# EAGLE design NQSMHS-V2.4B (EAGLE 5.11)

## Sheet 1 of 4
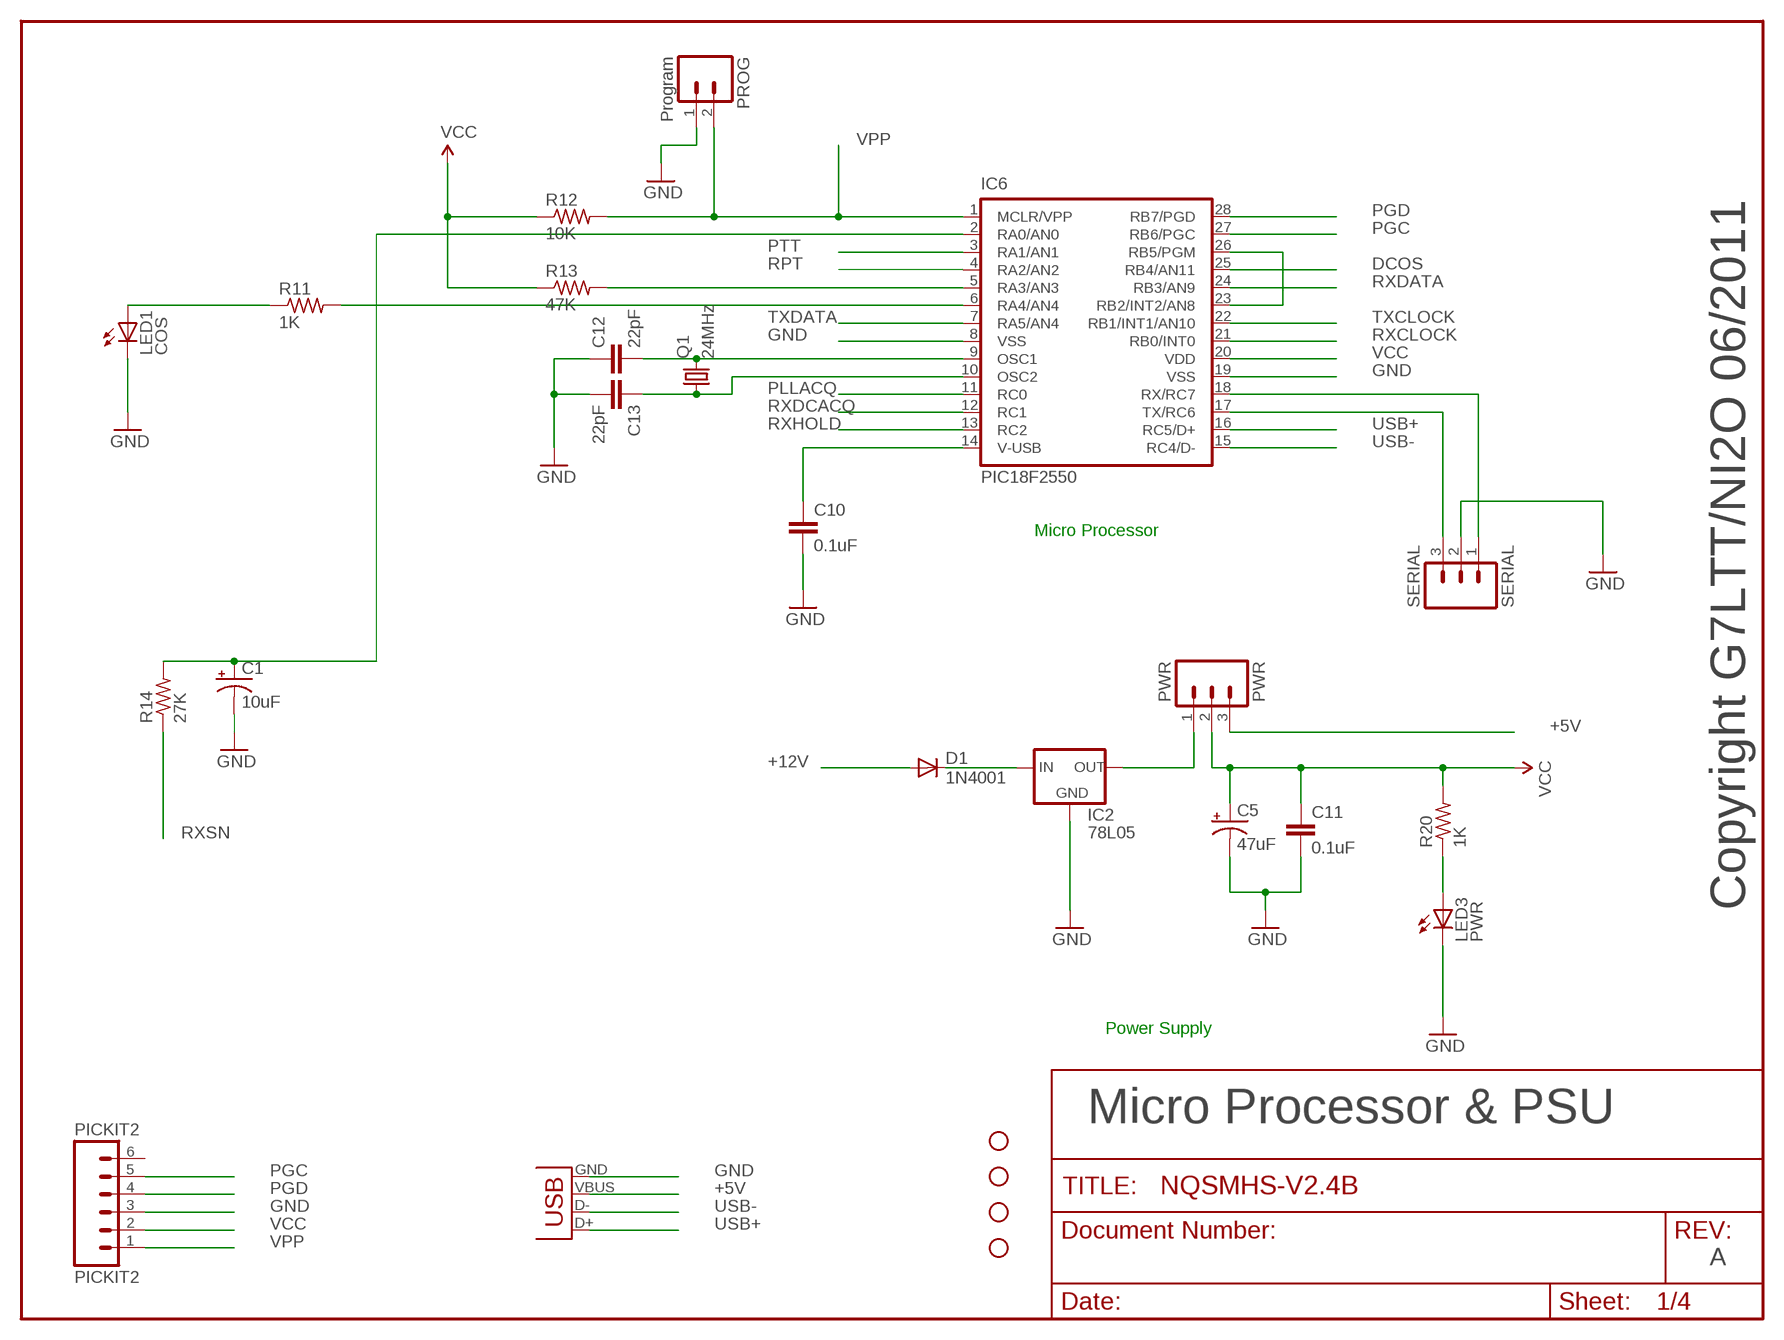
[diagram p0: schematic, sheet 1]

### Parts
C1  10uF  CAP_POLPTH2  [CPOL-RADIAL-10UF-25V]
C5  47uF  CAP_POLPTH2  [CPOL-RADIAL-10UF-25V]
C10  0.1uF  C2.5/2  [C2.5-2]
C11  0.1uF  C2.5/2  [C2.5-2]
C12  22pF  C2.5/2  [C2.5-2]
C13  22pF  C2.5/2  [C2.5-2]
D1  1N4001  DIODEPTH  [DIODE-1N4001]
IC2  78L05  78LXX  [78LXX]
IC6  PIC18F2550  [DIL28-3]
J1  USBPTH  [USB-B-PTH]
JP7  STAND-OFF  [STAND-OFF]
JP8  STAND-OFF  [STAND-OFF]
JP9  STAND-OFF  [STAND-OFF]
JP10  STAND-OFF  [STAND-OFF]
LED1  COS  LED3MM  [LED3MM]
LED3  PWR  LED3MM  [LED3MM]
PICKIT2  PICKIT2  M06SIP  [1X06]
PROG  Program  M02PTH  [1X02]
PWR  PWR  M03PTH  [1X03]
Q1  24MHz  CRYSTALHC49US  [HC49US]
R11  1K  R-US_0207/2V  [0207/2V]
R12  10K  R-US_0207/2V  [0207/2V]
R13  47K  R-US_0207/2V  [0207/2V]
R14  27K  R-US_0207/2V  [0207/2V]
R20  1K  R-US_0207/2V  [0207/2V]
SERIAL  SERIAL  M03PTH  [1X03]

### Nets
+5V: J1.VBUS PWR.3
+12V: D1.A ; also sheet 2
DCOS: IC6.25(RB4/AN11) ; also sheet 3
GND: C1.2(-) C5.2(-) C10.2 C11.2 C12.1 C13.2 IC2.GND IC6.8(VSS) IC6.19(VSS) J1.GND LED1.K(C) LED3.K(C) PICKIT2.3 PROG.1 SERIAL.2 ; also sheet 2,3,4
N$2: D1.C IC2.IN
N$3: IC6.23(RB2/INT2/AN8) IC6.26(RB5/PGM)
N$4: IC6.5(RA3/AN3) R13.2
N$5: IC6.6(RA4/AN4) R11.2
N$6: LED1.A R11.1
N$9: C12.2 IC6.9(OSC1) Q1.2
N$10: C13.1 IC6.10(OSC2) Q1.1
N$11: C10.1 IC6.14(V-USB)
N$12: IC2.OUT PWR.1
N$13: LED3.A R20.1
PGC: IC6.27(RB6/PGC) PICKIT2.5
PGD: IC6.28(RB7/PGD) PICKIT2.4
PLLACQ: IC6.11(RC0) ; also sheet 4
PTT: IC6.3(RA1/AN1) ; also sheet 2
RPT: IC6.4(RA2/AN2)
RX-232: IC6.18(RX/RC7) SERIAL.1
RXCLOCK: IC6.21(RB0/INT0) ; also sheet 4
RXDATA: IC6.24(RB3/AN9) ; also sheet 4
RXDCACQ: IC6.12(RC1) ; also sheet 4
RXHOLD: IC6.13(RC2) ; also sheet 4
RXSN: R14.1 ; also sheet 3,4
TX-232: IC6.17(TX/RC6) SERIAL.3
TX/SN: C1.1(+) IC6.2(RA0/AN0) R14.2
TXCLOCK: IC6.22(RB1/INT1/AN10) ; also sheet 4
TXDATA: IC6.7(RA5/AN4) ; also sheet 4
USB+: IC6.16(RC5/D+) J1.D+
USB-: IC6.15(RC4/D-) J1.D-
VCC: C5.1(+) C11.1 IC6.20(VDD) PICKIT2.2 PWR.2 R12.1 R13.1 R20.2 ; also sheet 2,3,4
VPP: IC6.1(MCLR/VPP) PICKIT2.1 PROG.2 R12.2
Unconnected: PICKIT2.6

### Notes on the sheet
- Micro Processor
- Copyright G7LTT/NI2O 06/2011
- Power Supply
- Micro Processor & PSU
- A

## Sheet 2 of 4
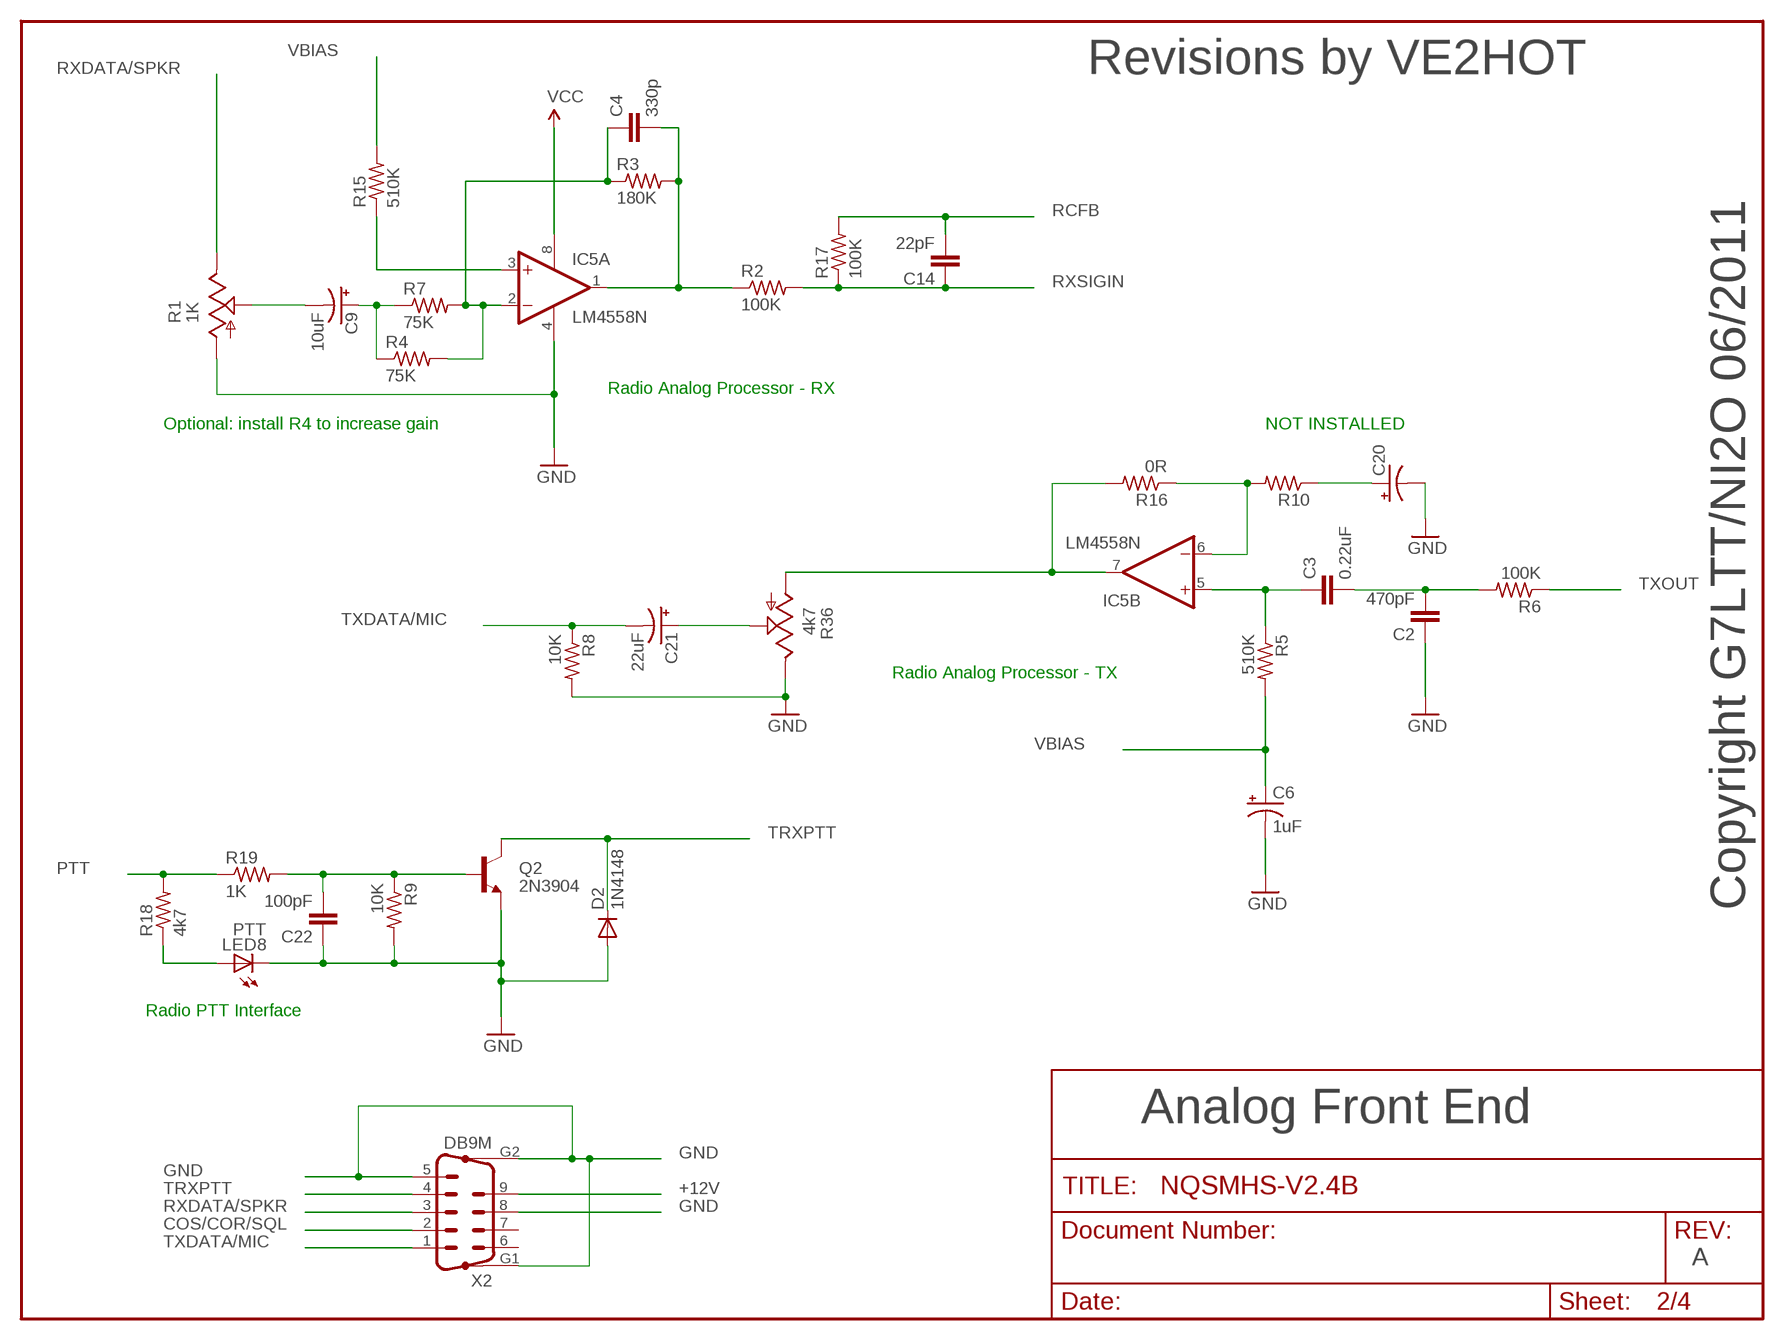
[diagram p1: schematic, sheet 2]

### Parts
C2  470pF  C2.5/2  [C2.5-2]
C3  0.22uF  C2.5/2  [C2.5-2]
C4  330p  C2.5/2  [C2.5-2]
C6  1uF  CAP_POLPTH2  [CPOL-RADIAL-10UF-25V]
C9  10uF  CAP_POLPTH2  [CPOL-RADIAL-10UF-25V]
C14  22pF  C2.5/2  [C2.5-2]
C20  CAP_POLPTH2  [CPOL-RADIAL-10UF-25V]
C21  22uF  CAP_POLPTH2  [CPOL-RADIAL-10UF-25V]
C22  100pF  C2.5/2  [C2.5-2]
D2  1N4148  [DO35-10]
IC5  LM4558N  [DIL08]
LED8  PTT  LED3MM  [LED3MM]
Q2  2N3904  TRANSISTOR_NPNTO92  [TO-92]
R1  1K  TRIM_US-CA6V  [CA6V]
R2  100K  R-US_0207/2V  [0207/2V]
R3  180K  R-US_0207/2V  [0207/2V]
R4  75K  R-US_0207/2V  [0207/2V]
R5  510K  R-US_0207/2V  [0207/2V]
R6  100K  R-US_0207/2V  [0207/2V]
R7  75K  R-US_0207/2V  [0207/2V]
R8  10K  R-US_0207/2V  [0207/2V]
R9  10K  R-US_0207/2V  [0207/2V]
R10  R-US_0207/2V  [0207/2V]
R15  510K  R-US_0207/2V  [0207/2V]
R16  0R  R-US_0207/2V  [0207/2V]
R17  100K  R-US_0207/2V  [0207/2V]
R18  4k7  R-US_0207/2V  [0207/2V]
R19  1K  R-US_0207/2V  [0207/2V]
R36  4k7  TRIM_US-CA6V  [CA6V]
X2  DB9M  M09HP  [M09HP]

### Nets
+12V: X2.9 ; also sheet 1
COS/COR/SQL: X2.2
GND: C2.1 C6.2(-) C20.2(-) C22.1 D2.A IC5.4(P:V-) LED8.K(C) Q2.1(E) R1.A R8.2 R9.2 R36.E X2.5 X2.8 X2.G1 X2.G2 ; also sheet 1,3,4
N$8: C2.2 C3.2 R6.2
N$15: C22.2 Q2.2(B) R9.1 R19.2
N$17: LED8.A R18.1
N$18: C9.2(-) R1.S
N$19: IC5.7(B:OUT) R16.2 R36.A
N$20: C9.1(+) R4.1 R7.1
N$23: C4.2 IC5.1(A:OUT) R2.1 R3.2
N$25: C3.1 IC5.5(B:+IN) R5.1
N$26: C4.1 IC5.2(A:-IN) R3.1 R4.2 R7.2
N$27: IC5.6(B:-IN) R10.2 R16.1
N$28: C20.1(+) R10.1
N$29: C21.1(+) R36.S
N$40: IC5.3(A:+IN) R15.1
PTT: R18.2 R19.1 ; also sheet 1
RCFB: C14.2 R17.2 ; also sheet 4
RXDATA/SPKR: R1.E X2.3
RXSIGIN: C14.1 R2.2 R17.1 ; also sheet 4
TRXPTT: D2.C Q2.3(C) X2.4
TXDATA/MIC: C21.2(-) R8.1 X2.1
TXOUT: R6.1 ; also sheet 4
VBIAS: C6.1(+) R5.2 R15.2 ; also sheet 4
VCC: IC5.8(P:V+) ; also sheet 1,3,4
Unconnected: X2.6 X2.7

### Notes on the sheet
- Revisions by VE2HOT
- Radio Analog Processor - RX
- Optional: install R4 to increase gain | NOT INSTALLED
- Radio Analog Processor - TX
- Copyright G7LTT/NI2O 06/2011
- Radio PTT Interface
- Analog Front End
- A

## Sheet 3 of 4
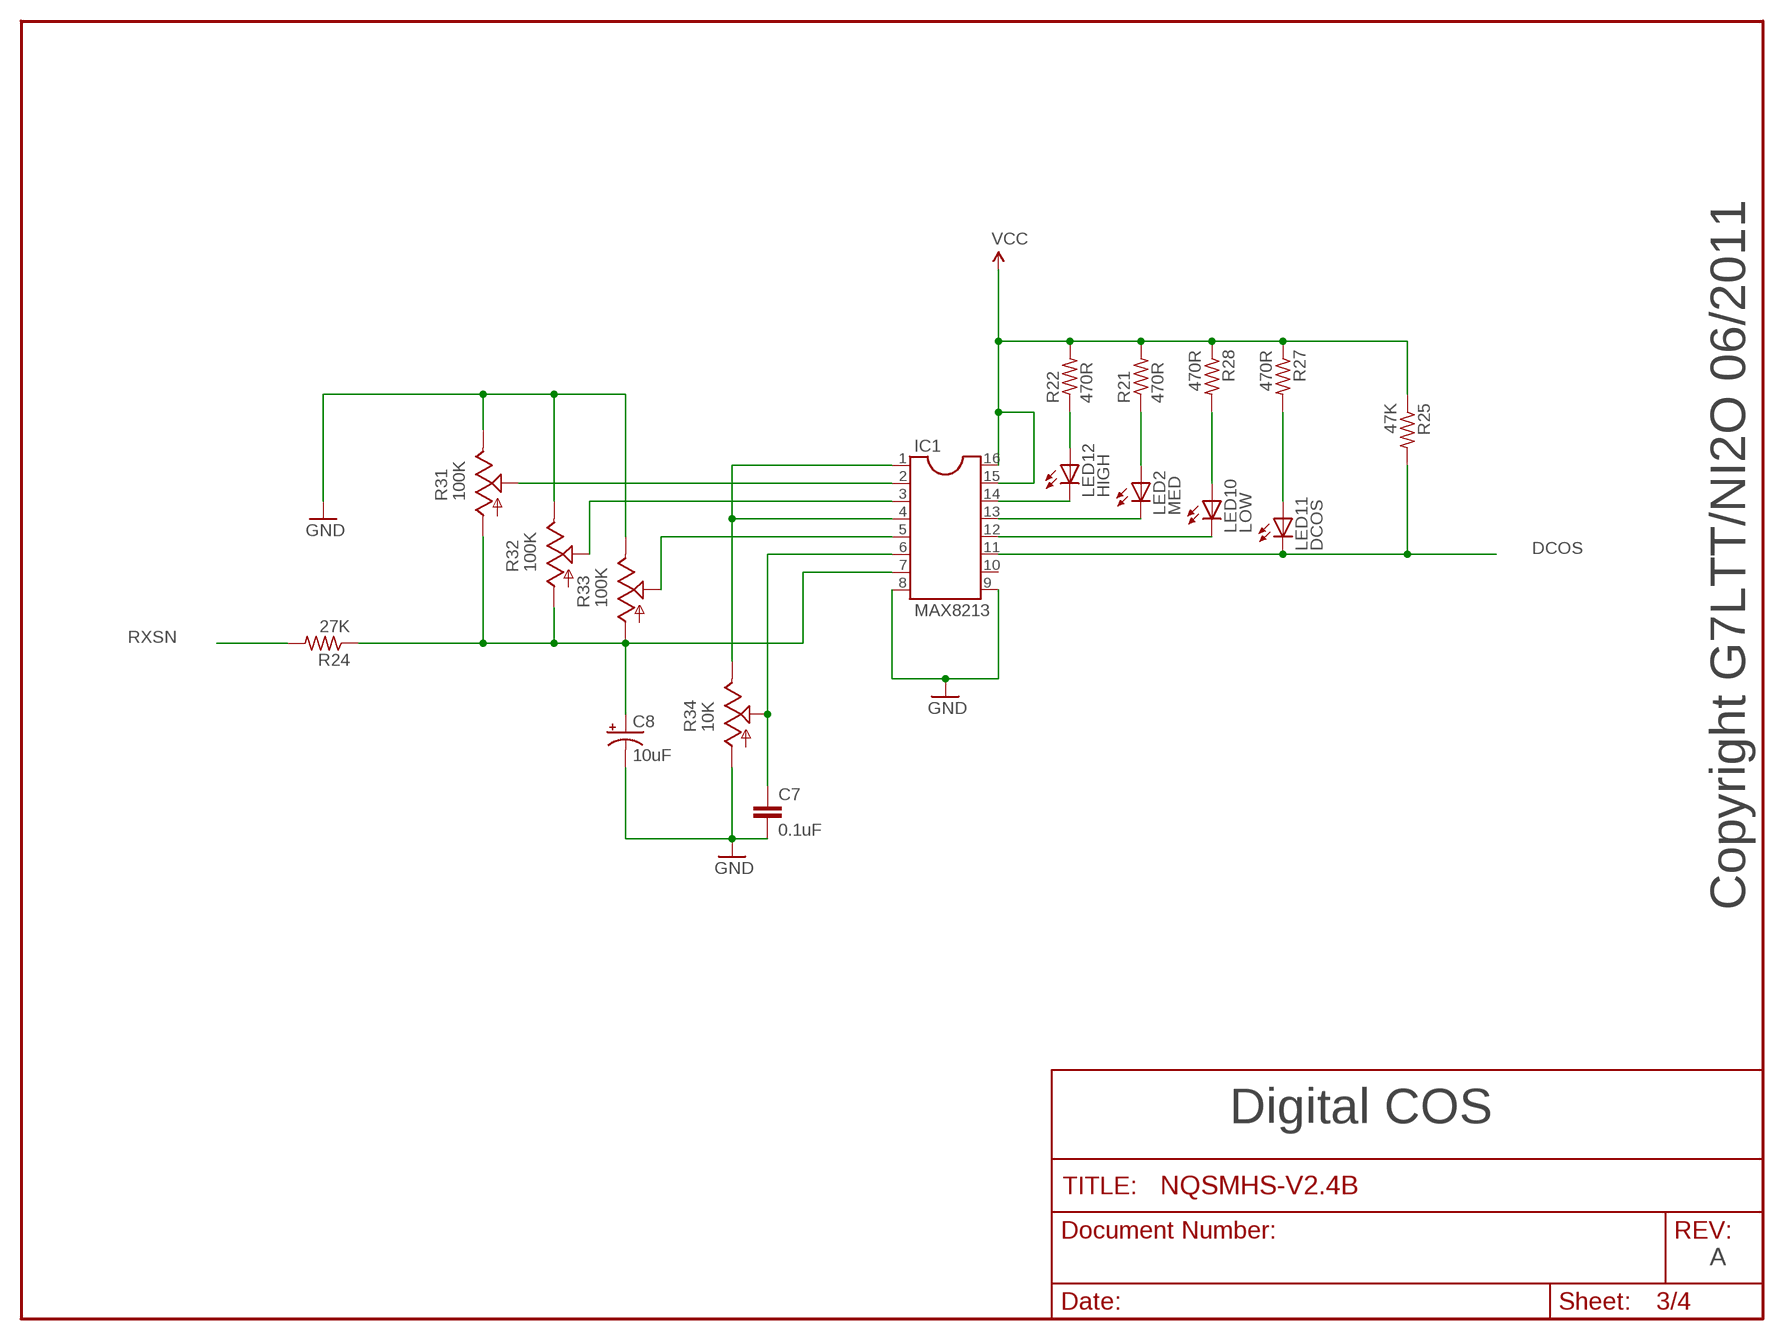
[diagram p2: schematic, sheet 3]

### Parts
C7  0.1uF  C2.5/2  [C2.5-2]
C8  10uF  CAP_POLPTH2  [CPOL-RADIAL-10UF-25V]
IC1  MAX8213  DIL16  [DIL16]
LED2  MED  LED3MM  [LED3MM]
LED10  LOW  LED3MM  [LED3MM]
LED11  DCOS  LED3MM  [LED3MM]
LED12  HIGH  LED3MM  [LED3MM]
R21  470R  R-US_0207/2V  [0207/2V]
R22  470R  R-US_0207/2V  [0207/2V]
R24  27K  R-US_0207/2V  [0207/2V]
R25  47K  R-US_0207/2V  [0207/2V]
R27  470R  R-US_0207/2V  [0207/2V]
R28  470R  R-US_0207/2V  [0207/2V]
R31  100K  TRIM_US-CA6V  [CA6V]
R32  100K  TRIM_US-CA6V  [CA6V]
R33  100K  TRIM_US-CA6V  [CA6V]
R34  10K  TRIM_US-CA6V  [CA6V]

### Nets
DCOS: IC1.11 LED11.K(C) R25.2 ; also sheet 1
GND: C7.2 C8.2(-) IC1.8 IC1.9 R31.E R32.E R33.E R34.A ; also sheet 1,2,4
N$14: C7.1 IC1.6 R34.S
N$16: IC1.14 LED12.K(C)
N$41: LED12.A R22.1
N$44: IC1.13 LED2.K(C)
N$45: LED2.A R21.1
N$46: IC1.12 LED10.K(C)
N$47: LED11.A R27.2
N$48: LED10.A R28.2
N$49: IC1.2 R31.S
N$50: IC1.3 R32.S
N$51: IC1.5 R33.S
N$52: IC1.1 IC1.4 R34.E
N$53: C8.1(+) IC1.7 R24.1 R31.A R32.A R33.A
RXSN: R24.2 ; also sheet 1,4
VCC: IC1.15 IC1.16 R21.2 R22.2 R25.1 R27.1 R28.1 ; also sheet 1,2,4
Unconnected: IC1.10

### Notes on the sheet
- Copyright G7LTT/NI2O 06/2011
- Digital COS
- A

## Sheet 4 of 4
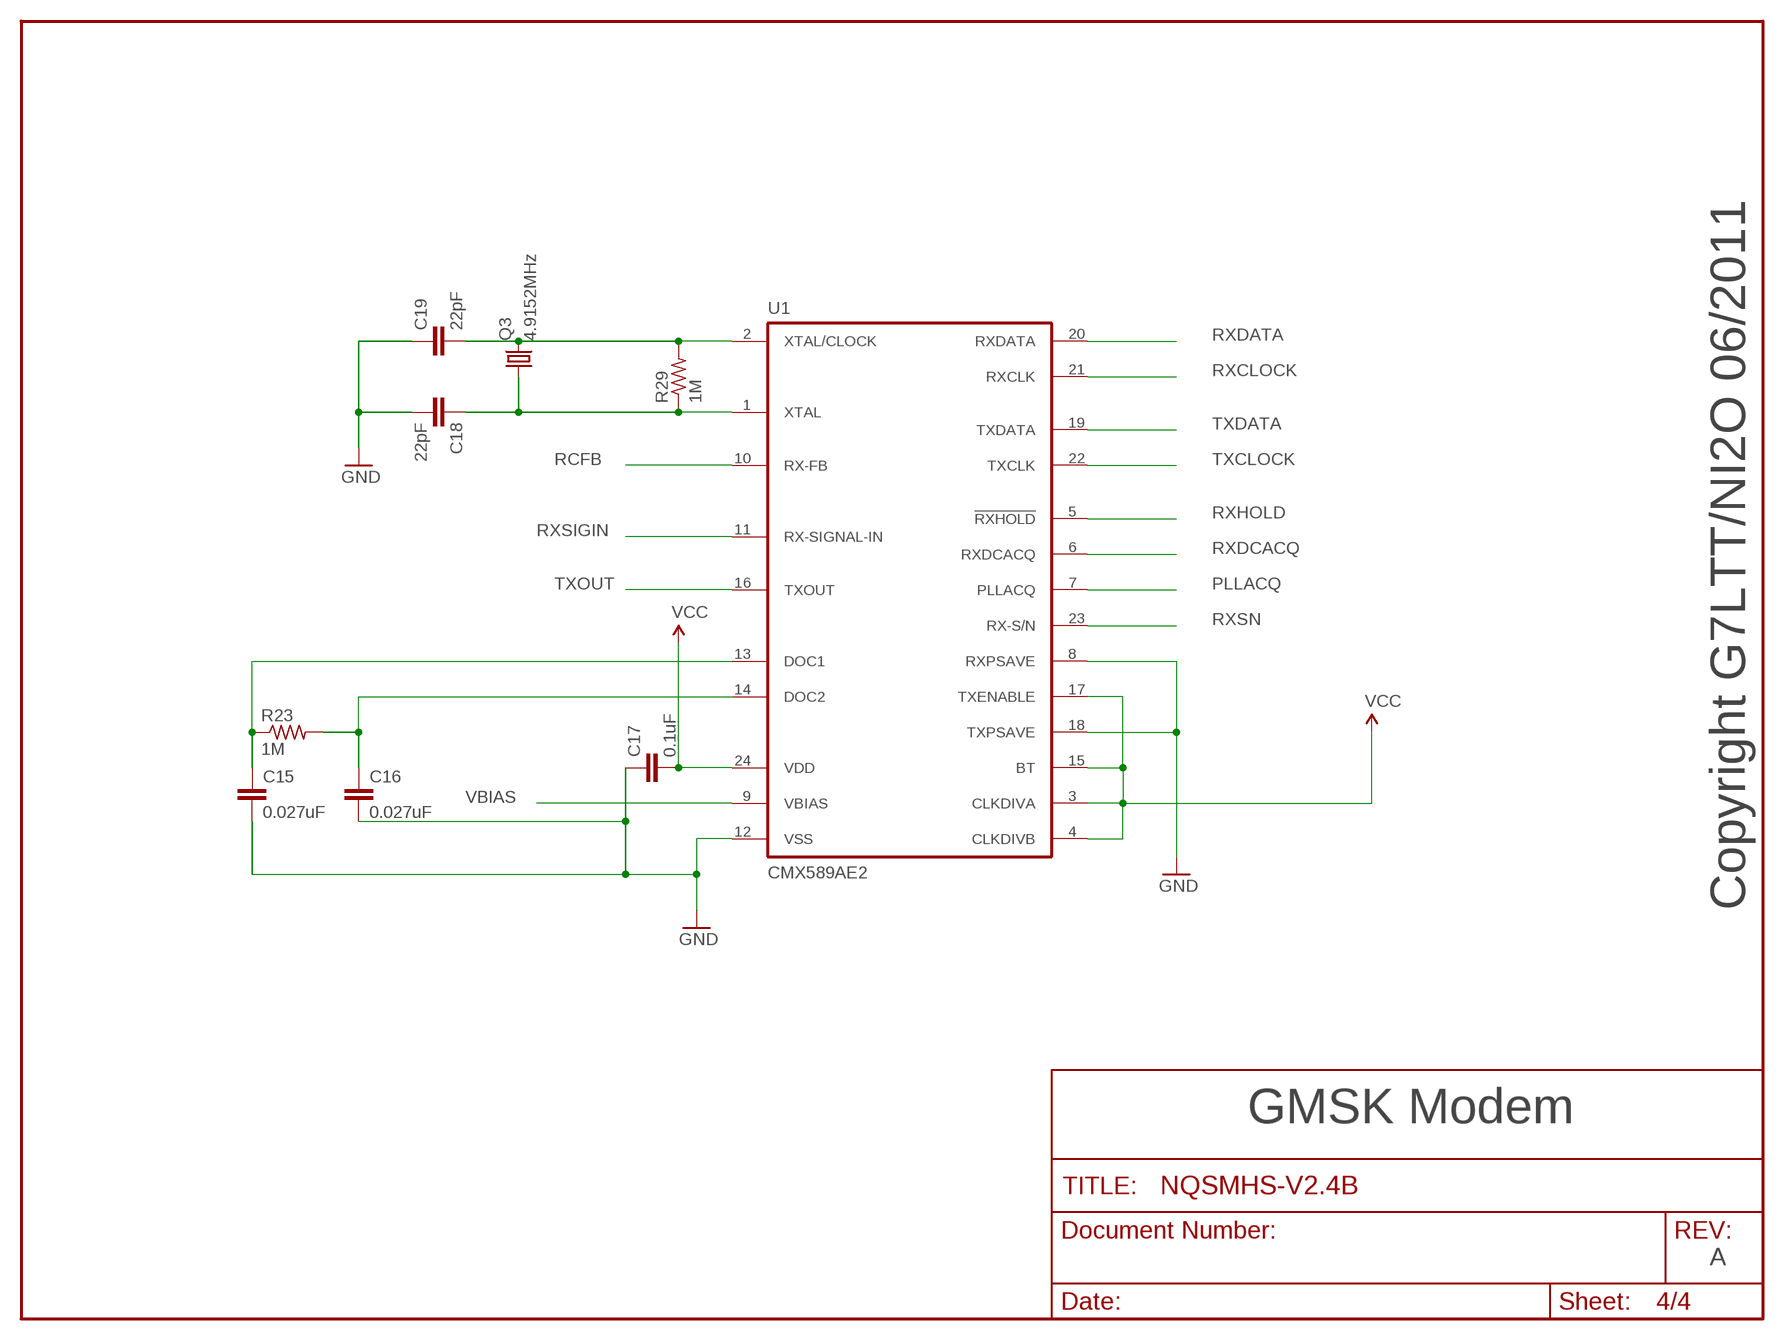
[diagram p3: schematic, sheet 4]

### Parts
C15  0.027uF  C2.5/2  [C2.5-2]
C16  0.027uF  C2.5/2  [C2.5-2]
C17  0.1uF  C2.5/2  [C2.5-2]
C18  22pF  C2.5/2  [C2.5-2]
C19  22pF  C2.5/2  [C2.5-2]
Q3  4.9152MHz  CRYSTALHC49US  [HC49US]
R23  1M  R-US_0207/2V  [0207/2V]
R29  1M  R-US_0207/2V  [0207/2V]
U1  CMX589AE2  [TSSOP24]

### Nets
GND: C15.2 C16.2 C17.1 C18.2 C19.1 U1.8(RXPSAVE) U1.12(VSS) U1.18(TXPSAVE) ; also sheet 1,2,3
N$1: C15.1 R23.1 U1.13(DOC1)
N$21: C16.1 R23.2 U1.14(DOC2)
N$22: C18.1 Q3.1 R29.1 U1.1(XTAL)
N$24: C19.2 Q3.2 R29.2 U1.2(XTAL/CLOCK)
PLLACQ: U1.7(PLLACQ) ; also sheet 1
RCFB: U1.10(RX-FB) ; also sheet 2
RXCLOCK: U1.21(RXCLK) ; also sheet 1
RXDATA: U1.20(RXDATA) ; also sheet 1
RXDCACQ: U1.6(RXDCACQ) ; also sheet 1
RXHOLD: U1.5(!RXHOLD!) ; also sheet 1
RXSIGIN: U1.11(RX-SIGNAL-IN) ; also sheet 2
RXSN: U1.23(RX-S/N) ; also sheet 1,3
TXCLOCK: U1.22(TXCLK) ; also sheet 1
TXDATA: U1.19(TXDATA) ; also sheet 1
TXOUT: U1.16(TXOUT) ; also sheet 2
VBIAS: U1.9(VBIAS) ; also sheet 2
VCC: C17.2 U1.3(CLKDIVA) U1.4(CLKDIVB) U1.15(BT) U1.17(TXENABLE) U1.24(VDD) ; also sheet 1,2,3

### Notes on the sheet
- Copyright G7LTT/NI2O 06/2011
- GMSK Modem
- A

## Library data of the parts
C1 C5 C6 C8 C9 C20 C21 = SparkFun:CAP_POL: Capacitor Polarized These are standard SMD and PTH capacitors. Normally 10uF, 47uF, and 100uF in electrolytic and tantalum varieties. Always verify the external diameter of the through hole cap, it varies with capacity, voltage, and manufacturer. The EIA devices should be standard.
C2-C4 C7 C10-C19 C22 = capacitor-wima:C: CAPACITOR naming: grid - package width
D1 = SparkFun:DIODE: Diode These are standard reverse protection diodes and small signal diodes. SMA package can handle up to about 1A. SOD-323 can handle about 200mA. What the SOD-323 package when ordering, there are some mfgs out there that are 5-pin packages.
D2 = diode-1:1N4148: DIODE high speed (Philips)
IC1 = ic-package:DIL16: Dual In Line / Socket
IC2 = v-reg:78LXX: VOLTAGE REGULATOR
IC5 = linear:*4558: OP AMP
IC6 = SparkFun:PIC18F2550
J1 = SparkFun:USB: USB Connectors USB-B-PTH is fully proven SKU : PRT-00139 USB-miniB is fully proven SKU : PRT-00587 USB-A-PCB is untested. USB-A-H is throughly reviewed, but untested. Spark Fun Electronics SKU : PRT-00437 USB-B-SMT is throughly reviewed, but untested. Needs silkscreen touching up. USB-A-S has not been used/tested USB-MB-H has not been used/tested
JP7-JP10 = SparkFun:STAND-OFF: Stand Off This is the mechanical footprint for a #4 phillips button head screw. Use the keepout ring to avoid running the screw head into surrounding components. SKU : PRT-00447
LED1-LED3 LED8 LED10-LED12 = SparkFun:LED: LEDs Standard schematic elements and footprints for 5mm, 3mm, 1206, and 0603 sized LEDs. 5mm - Spark Fun Electronics SKU : COM-00529 (and others)
PICKIT2 = SparkFun:M06: Header 6 Standard 6-pin 0.1" header. Use with straight break away headers (SKU : PRT-00116), right angle break away headers (PRT-00553), swiss pins (PRT-00743), machine pins (PRT-00117), and female headers (PRT-00115). Molex polarized connector foot print use with SKU : PRT-08094 with associated crimp pins and housings. NOTES ON THE VARIANTS LOCK and LOCK_LONGPADS... This footprint was designed to help hold the alignment of a through-hole component (i.e. 6-pin header) while soldering it into place. You may notice that each hole has been shifted either up or down by 0.005 of an inch from it's more standard position (which is a perfectly straight line). This slight alteration caused the pins (the squares in the middle) to touch the edges of the holes. Because they are alternating, it causes a "brace" to hold the component in place. 0.005 has proven to be the perfect amount of "off-center" position when using our standard breakaway headers. Although looks a little odd when you look at the bare footprint, once you have a header in there, the alteration is very hard to notice. Also, if you push a header all the way into place, it is covered up entirely on the bottom side. This idea of altering the position of holes to aid alignment will be further integrated into the Sparkfun Library for other footprints. It can help hold any component with 3 or more connection pins.
PROG = SparkFun:M02: Header 2 Standard 2-pin 0.1" header. Use with straight break away headers (SKU : PRT-00116), right angle break away headers (PRT-00553), swiss pins (PRT-00743), machine pins (PRT-00117), and female headers (PRT-00115). Molex polarized connector foot print use with SKU : PRT-08233 with associated crimp pins and housings.
PWR SERIAL = SparkFun:M03: Header 3 Standard 3-pin 0.1" header. Use with straight break away headers (SKU : PRT-00116), right angle break away headers (PRT-00553), swiss pins (PRT-00743), machine pins (PRT-00117), and female headers (PRT-00115). Molex polarized connector foot print use with SKU : PRT-08232 with associated crimp pins and housings.
Q1 Q3 = SparkFun:CRYSTAL: Crystals Various standard crystals. Proven footprints. Spark Fun Electronics SKU : COM-00534
Q2 = SparkFun:TRANSISTOR_NPN: Transistor NPN BJT configuration in SOT23 package. MMBT2222 is the common NPN we use. Double check BCE configuration again layout.
R1 R31-R34 R36 = pot:TRIM_US-: POTENTIOMETER
R2-R25 R27-R29 = resistor:R-US_: RESISTOR, American symbol
U1 = cml-micro:CMX589A: HIGH-SPEED GMSK MODEM
X2 = con-subd:M09HP: SUB-D

## Board
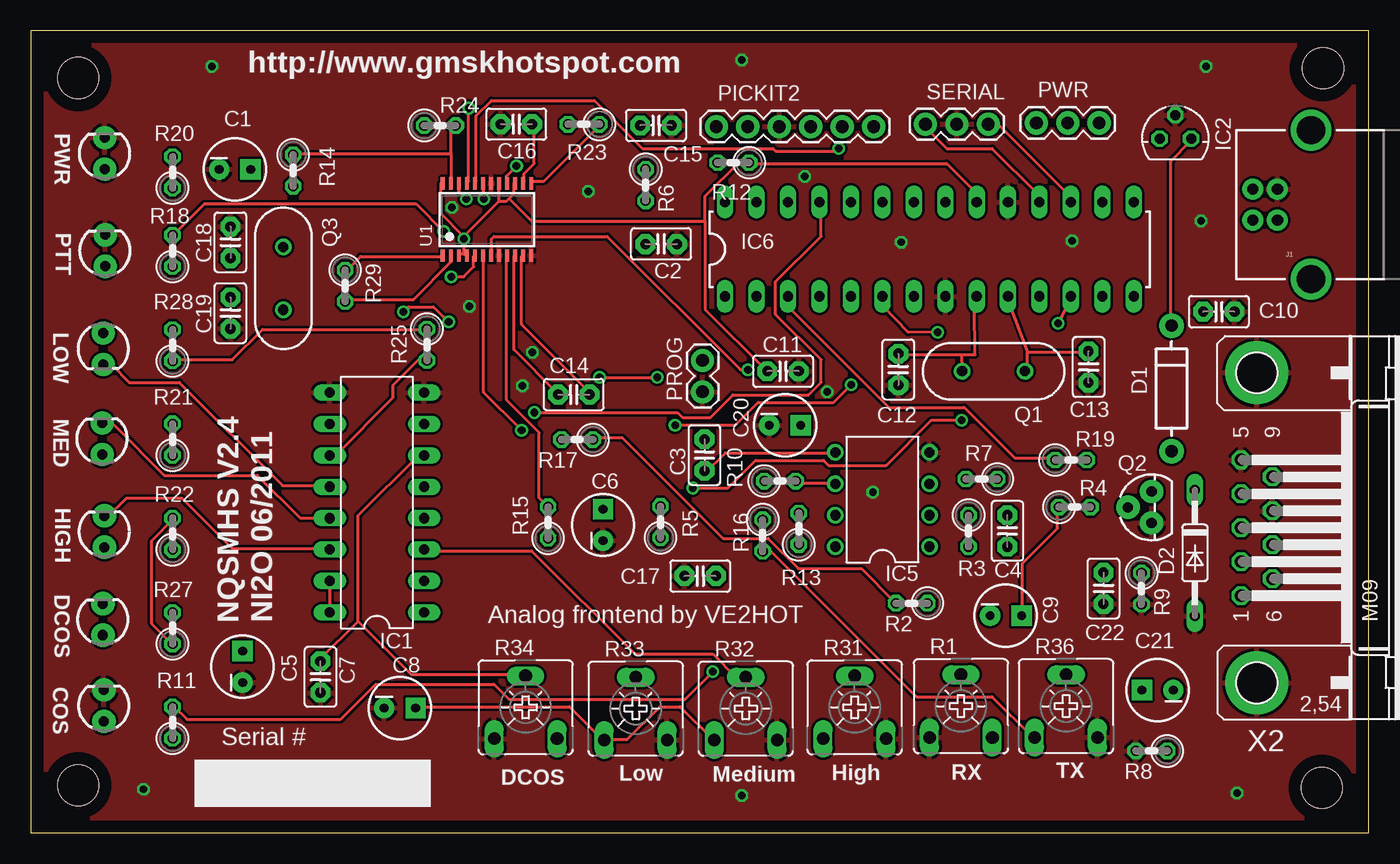
[diagram p4: board, top side]
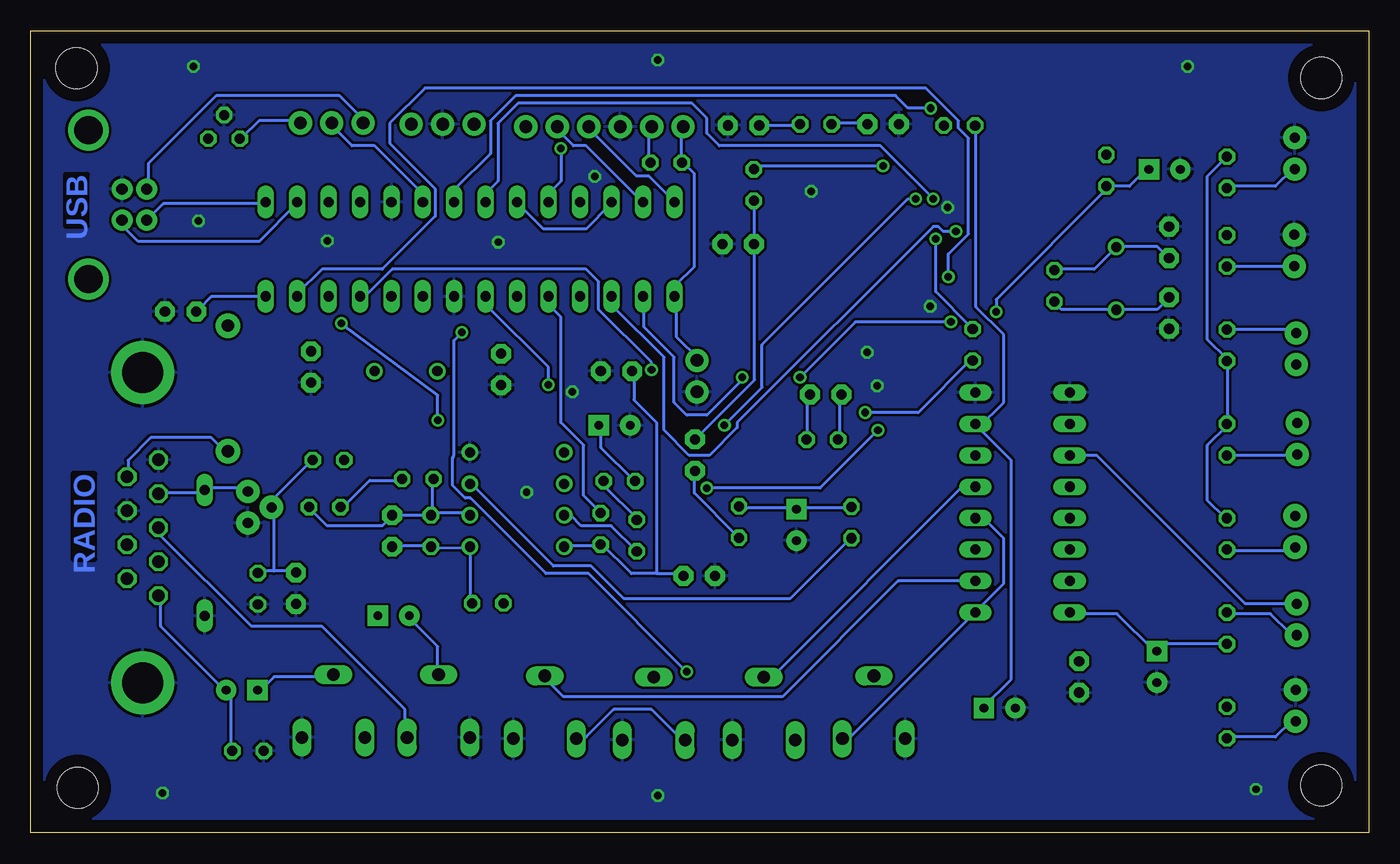
[diagram p5: board, bottom side, seen from below]

Size 108.03 x 64.76 mm. Coordinates in mm from the lower left corner, seen from the top.
Outline: 108.03,0 108.03,64.76 0,64.76 0,0 108.03,0
Copper layers (1*16): Top 0.035mm / dielectric 1.5mm / Bottom 0.035mm
Design rules "default": minimum track width 10mil, minimum drill 24mil, track to track 8mil, track to pad 8mil, pad to pad 8mil, via to via 8mil, smd to smd 8mil, copper to edge 40mil, drill to drill 8mil, minimum pad ring 10mil, minimum via ring 8mil, stop-mask expansion 4mil, vias tented up to drill 0mil, thermal gap 10mil

### Footprints (pad centres in the part's own frame; a part is rotated, then mirrored left to right if it is on the bottom)
CPOL-RADIAL-10UF-25V = drill 0.7 pad 1.651 square: 1 1.27,0 | drill 0.7 pad 1.651 round: 2 -1.27,0
C2.5-2 = drill 0.813 pad 1.6 octagon: 1 -1.27,0; 2 1.27,0
DIODE-1N4001 = drill 1 pad 1.981 round: A -5.08,0; C 5.08,0
DO35-10 = drill 0.813 long: A 5.08,0; C -5.08,0
DIL16 = drill 0.813 long: 1 -8.89,-3.81; 2 -6.35,-3.81; 3 -3.81,-3.81; 4 -1.27,-3.81; 5 1.27,-3.81; 6 3.81,-3.81; 7 6.35,-3.81; 8 8.89,-3.81; 9 8.89,3.81; 10 6.35,3.81; 11 3.81,3.81; 12 1.27,3.81; 13 -1.27,3.81; 14 -3.81,3.81; 15 -6.35,3.81; 16 -8.89,3.81
78LXX = drill 0.813 octagon: GND 0,1.905; IN 1.27,0; OUT -1.27,0
DIL08 = drill 0.813 pad 1.27 round: 1 -3.81,-3.81; 2 -1.27,-3.81; 3 1.27,-3.81; 4 3.81,-3.81; 5 3.81,3.81; 6 1.27,3.81; 7 -1.27,3.81; 8 -3.81,3.81
DIL28-3 = drill 0.813 long: 1 -16.51,-3.81; 2 -13.97,-3.81; 3 -11.43,-3.81; 4 -8.89,-3.81; 5 -6.35,-3.81; 6 -3.81,-3.81; 7 -1.27,-3.81; 8 1.27,-3.81; 9 3.81,-3.81; 10 6.35,-3.81; 11 8.89,-3.81; 12 11.43,-3.81; 13 13.97,-3.81; 14 16.51,-3.81; 15 16.51,3.81; 16 13.97,3.81; 17 11.43,3.81; 18 8.89,3.81; 19 6.35,3.81; 20 3.81,3.81; 21 1.27,3.81; 22 -1.27,3.81; 23 -3.81,3.81; 24 -6.35,3.81; 25 -8.89,3.81; 26 -11.43,3.81; 27 -13.97,3.81; 28 -16.51,3.81
USB-B-PTH = drill 0.914 pad 1.676 round: D+ 0,1.25; D- 1.981,1.25; GND 0,-1.25; VBUS 1.981,-1.25 | drill 2.286 round: P$1 -2.718,-6.02; P$2 -2.718,6.02
STAND-OFF = hole 3.302: 0,0
LED3MM = drill 0.813 pad 1.88 round: A -1.27,0; K 1.27,0
1X06 = drill 1.016 pad 1.88 round: 1 0,0; 2 2.54,0; 3 5.08,0; 4 7.62,0; 5 10.16,0; 6 12.7,0
1X02 = drill 1.016 pad 1.88 round: 1 0,0; 2 2.54,0
1X03 = drill 1.016 pad 1.88 round: 1 0,0; 2 2.54,0; 3 5.08,0
HC49US = drill 0.813 round: 1 -2.54,0; 2 2.54,0
TO-92 = drill 0.813 pad 1.88 round: 1 -1.27,0; 2 0,1.905; 3 1.27,0
CA6V = drill 1.016 long: A -2.54,-2.54; E 2.54,-2.54; S 0,2.54
0207/2V = drill 0.813 octagon: 1 -1.27,0; 2 1.27,0
TSSOP24 = smd 0.305 x 0.991: 1 -3.575,-2.918; 2 -2.925,-2.918; 3 -2.275,-2.918; 4 -1.625,-2.918; 5 -0.975,-2.918; 6 -0.325,-2.918; 7 0.325,-2.918; 8 0.975,-2.918; 9 1.625,-2.918; 10 2.275,-2.918; 11 2.925,-2.918; 12 3.575,-2.918; 13 3.575,2.918; 14 2.925,2.918; 15 2.275,2.918; 16 1.625,2.918; 17 0.975,2.918; 18 0.325,2.918; 19 -0.325,2.918; 20 -0.975,2.918; 21 -1.625,2.918; 22 -2.275,2.918; 23 -2.925,2.918; 24 -3.575,2.918
M09HP = drill 1.016 octagon: 1 -5.486,1.27; 2 -2.743,1.27; 3 0,1.27; 4 2.743,1.27; 5 5.486,1.27; 6 -4.115,-1.27; 7 -1.372,-1.27; 8 1.372,-1.27; 9 4.115,-1.27 | drill 3.302 pad 5.08 round: G1 -12.522,0; G2 12.522,0

### Placement (x,y rotation side)
C1  16.47,53.58 0 top
C2  50.9,47.55 180 top
C3  54.4,30.5 90 top
C4  78.86,24.37 270 top
C5  17.09,13.4 90 top
C6  46.2,24.86 90 top
C7  23.38,12.58 270 top
C8  29.79,10.06 0 top
C9  78.73,17.52 0 top
C10  95.94,42.08 0 top
C11  60.74,37.27 0 top
C12  70.05,37.41 90 top
C13  85.42,37.61 270 top
C14  43.84,35.39 180 top
C15  50.48,57.13 0 top
C16  39.2,57.23 180 top
C17  54.05,20.73 0 top
C18  16.11,47.69 90 top
C19  16.11,41.97 90 top
C20  60.9,32.9 0 top
C21  90.99,11.52 180 top
C22  86.63,19.73 90 top
D1  92.11,35.88 90 top
D2  94,22.6 270 top
IC1  27.94,26.67 90 top
IC2  92.43,56.06 0 top
IC5  68.77,26.91 90 top
IC6  72.57,47.13 0 top
J1  100.67,50.73 180 top
JP7  3.81,3.81 0 top
JP8  104.25,3.61 0 top
JP9  3.81,60.96 0 top
JP10  104.35,61.76 0 top
LED1  5.89,10.26 90 top
LED2  5.75,31.82 90 top
LED3  5.96,54.87 90 top
LED8  5.99,47.02 90 top
LED10  5.83,39.08 270 top
LED11  5.81,17.22 90 top
LED12  5.93,24.32 90 top
PICKIT2  55.36,57.03 0 top
PROG  54.24,35.6 90 top
PWR  86.28,57.33 180 top
Q1  77.75,37.27 180 top
Q2  90.51,26.28 90 top
Q3  20.38,44.77 270 top
R1  75.11,10.22 0 top
R2  71.14,18.52 180 top
R3  75.72,24.37 270 top
R4  84.3,26.3 0 top
R5  50.85,25.09 90 top
R6  49.65,52.31 270 top
R7  76.79,28.56 180 top
R8  90.5,6.6 180 top
R9  89.7,19.7 270 top
R10  60.5,28.4 0 top
R11  11.43,8.89 90 top
R12  56.73,54.12 180 top
R13  62.02,24.54 90 top
R14  21.18,53.49 270 top
R15  41.76,25.05 90 top
R16  59.1,24 270 top
R17  44.11,31.75 180 top
R18  11.43,46.99 90 top
R19  84,30.1 0 top
R20  11.43,53.34 90 top
R21  11.43,31.75 90 top
R22  11.43,24.13 90 top
R23  44.64,57.22 180 top
R24  33.04,57.12 0 top
R25  31.97,39.41 270 top
R27  11.43,16.51 90 top
R28  11.43,39.37 90 top
R29  25.37,44.17 270 top
R31  66.52,10.12 0 top
R32  57.73,10.02 0 top
R33  48.84,10.02 0 top
R34  39.95,10.12 0 top
R36  83.6,10.22 0 top
SERIAL  72.24,57.23 0 top
U1  36.83,49.53 0 top
X2  99,24.63 90 top

### Tracks (layer width: path | path; a pad name or v marks a point on that pad's centre or on a via)
+5V
  Bottom 0.254: J1.VBUS 98.55,52.02 98.55,54.05 93.07,59.54 83.11,59.54 81.08,57.51 PWR.3
+12V
  Bottom 0.254: X2.9 100.18,28.85 100.18,30.07 98.35,31.9 93.47,31.9 92.25,30.68 D1.A
DCOS  (via drill 0.61)
  Top 0.254: IC1.11 24.59,30.48 29.26,35.15 29.26,36.17 31.29,38.2 31.9,38.2 R25.2 | v40.64,33.93 52.22,33.93 52.63,33.53 54.86,33.53 56.69,35.36 62.79,35.36 63.8,36.37 63.8,38.2 60.15,41.86 60.15,44.5 63.8,48.16 63.8,50.8 IC6.25
  Bottom 0.254: v40.64,33.93 36.37,33.93 32.11,38.2 R25.2 | LED11.K 5.89,18.49 9.96,18.49 21.95,30.48 IC1.11
GND  (via drill 0.6)
  other vias: 45,51.8 39.7,36.1 62.5,53 35.4,42.5 94.5,49.4 34,50.5 40.5,38.8 64.3,35.6 68,27.5 70.3,47.7 84.1,47.8 94.9,61.9 57.4,62.4 14.6,61.9 9.1,3.5 97.4,3.2 57.4,3
  pour Bottom: -0.1,64.77 108.06,64.87 107.96,0 0,0
  pour Top: 0,-0.23 107.95,-0.03 108.05,64.85 0.1,64.75
N$1
  Top 0.254: U1.13 40.44,52.63 41.45,52.63 45.92,57.1 R23.1
  Bottom 0.254: C15.1 49.17,57.1 45.92,57.1 R23.1
N$2
  Top 0.254: IC2.IN 93.67,55.88 92.05,54.25 92.05,41.05 D1.C
N$3
  Bottom 0.254: IC6.26 61.16,50.8 63.2,48.77 66.65,48.77 68.68,50.8 IC6.23
N$4
  Bottom 0.254: R13.2 62.18,26.01 63.4,27.23 63.4,31.29 65.23,33.12 65.23,41.66 66.04,42.47 66.04,43.28 IC6.5
N$5  (via drill 0.6, 0.61)
  Top 0.254: v55.07,13.01 52.83,10.77 38.61,10.77 37.39,11.99 27.84,11.99 24.99,9.14 12.6,9.14 11.58,10.16 R11.2 | v73.23,40.4 70.83,40.42 68.89,42.47 68.89,43.28 IC6.6
  Bottom 0.254: v55.07,13.01 62.99,20.93 66.45,20.93 72.54,27.03 72.95,27.03 73.97,28.04 73.97,30.28 73.87,30.48 73.87,39.77 v73.23,40.4
N$6
  Bottom 0.254: R11.1 11.38,7.72 7.52,7.72 6.3,8.94 5.89,8.94 LED1.A
N$8
  Bottom 0.254: R6.2 49.58,51 49.58,47.75 C2.2 49.58,47.55 49.58,36.58 54.25,31.9 C3.2
N$9
  Top 0.254: 75.17,38.61 75.18,37.39 Q1.2 | 75.17,38.61 70.1,38.61 C12.2 | 75.17,38.61 76.24,38.61 76.2,42.47 76.2,43.28 IC6.9
N$10
  Top 0.254: 80.51,38.81 85.34,38.81 C13.1 | 80.51,38.81 80.49,38.81 80.47,37.39 Q1.1 | 80.51,38.81 79.05,42.67 79.05,43.28 IC6.10
N$11
  Bottom 0.254: IC6.14 89.2,43.28 93.47,43.28 94.49,42.27 C10.1
N$12
  Bottom 0.254: IC2.OUT 91.03,56.08 89.61,57.51 86.36,57.51 PWR.1
N$13
  Bottom 0.254: R20.1 11.38,52.22 7.52,52.22 6.1,53.65 LED3.A
N$14
  Top 0.254: 26.42,17.07 26.42,25.6 31.29,30.48 IC1.6 | 26.42,17.07 23.37,14.02 C7.1 | 26.42,17.07 30.68,12.8 39.83,12.8 R34.S
N$15
  Bottom 0.254: 88.39,21.13 86.77,21.13 C22.2 | 88.39,21.13 89.61,21.13 R9.1 | 88.39,27.03 88.59,26.82 88.59,26.42 Q2.2 88.39,27.03 | 88.39,27.03 85.34,30.07 R19.2 | 88.39,21.13 88.39,27.03
N$16
  Top 0.254: IC1.14 23.98,22.96 16.26,22.96 12.19,27.03 7.72,27.03 6.1,25.4 LED12.K
N$17
  Bottom 0.254: R18.1 6.1,45.72 LED8.A
N$18
  Bottom 0.254: R1.S 75.18,12.8 75.18,15.04 77.62,17.48 C9.2
N$19
  Top 0.254: R36.A 80.87,7.72 77.62,10.97 71.53,10.97 59.74,22.76 59.13,22.76 R16.2
  Bottom 0.254: R16.2 59.13,22.76 61.16,24.79 63.6,24.79 64.41,25.6 64.82,25.6 IC5.7
N$20
  Top 0.254: C9.1 80.06,17.68 80.06,21.74 82.91,24.59 82.91,26.21 R4.1
  Bottom 0.254: R7.1 78.23,28.45 80.67,28.45 82.91,26.21 R4.1
N$21
  Top 0.254: U1.14 39.83,52.63 39.83,53.24 40.64,54.05 40.64,57.1 C16.1
  Bottom 0.254: R23.2 43.28,57.3 40.64,57.3 C16.1
N$22
  Top 0.254: U1.1 33.12,46.53 26.62,46.53 25.4,45.31 R29.1
  Bottom 0.254: C18.1 16.26,46.53 17.07,47.35 20.32,47.35 Q3.1 20.52,47.14 22.15,45.52 25.2,45.52 R29.1
N$23
  Bottom 0.254: C4.2 78.84,23.16 75.79,23.16 R3.2 75.59,22.96 72.54,23.01 72.54,22.96 | 72.54,22.96 72.54,18.69 R2.1 | 72.54,22.96 IC5.1
N$24
  Top 0.254: U1.2 33.93,46.53 33.93,46.13 30.89,43.08 25.4,43.08 R29.2
  Bottom 0.254: C19.2 16.26,43.08 17.07,42.27 20.32,42.27 Q3.2 20.52,42.27 24.79,42.27 25.4,42.88 R29.2
N$25
  Top 0.254: IC5.5 64.82,30.68 56.08,30.68 54.46,29.06 C3.1
  Bottom 0.254: R5.1 51,23.98 54.46,27.43 54.46,29.06 C3.1
N$26
  Bottom 0.254: 75.59,25.81 72.75,25.81 IC5.2 | 75.59,25.81 75.59,28.45 R7.2 | 75.59,25.81 R3.1 75.79,25.6 78.84,25.6 | 78.84,25.6 79.65,24.79 84.12,24.79 85.55,26.21 R4.2 | 78.84,25.6 C4.1
N$27
  Top 0.254: IC5.6 64.82,28.25 61.77,28.25 R10.2
  Bottom 0.254: R16.1 59.13,25.4 61.57,27.84 61.57,28.25 R10.2
N$28
  Bottom 0.254: R10.1 59.33,28.45 61.98,31.09 61.98,32.72 C20.1
N$29
  Bottom 0.254: R36.S 83.72,12.6 88.39,12.6 89.61,11.38 C21.1
N$40
  Bottom 0.254: R15.1 41.86,23.77 46.74,18.9 60.15,18.9 62.79,21.54 65.84,21.54 72.54,28.25 IC5.3
N$41
  Bottom 0.254: R22.1 11.38,22.76 6.3,22.76 6.1,22.96 LED12.A
N$44
  Top 0.254: IC1.13 21.74,25.4 18.29,28.85 10.77,28.85 6.71,32.92 5.89,32.92 LED2.K
N$45
  Bottom 0.254: R21.1 5.89,30.48 LED2.A
N$46
  Top 0.254: IC1.12 23.98,28.04 20.32,28.04 11.99,36.37 7.92,36.37 6.5,37.8 5.89,37.8 LED10.K
N$47
  Bottom 0.254: R27.2 11.38,17.68 7.92,17.68 6.3,16.05 5.89,16.05 LED11.A
N$48
  Bottom 0.254: R28.2 6.1,40.64 5.89,40.44 LED10.A
N$49
  Bottom 0.254: IC1.2 38,20.32 47.35,10.97 65.02,10.97 66.65,12.6 R31.S
N$50
  Top 0.254: IC1.3 31.9,22.76 40.44,22.76 48.77,14.43 55.07,14.43 56.9,12.6 57.71,12.6 R32.S
N$51
  Bottom 0.254: IC1.5 31.9,27.84 32.92,27.84 48.16,12.6 48.77,12.6 R33.S
N$52
  Bottom 0.254: IC1.4 31.09,25.4 29.46,23.77 29.46,20.12 31.7,17.88 IC1.1 31.9,17.68 41.86,7.72 42.47,7.72 R34.E
N$53
  Top 0.254: R32.A 55.07,7.52 52.43,10.16 50.8,10.16 48.16,7.52 46.33,7.52 R33.A 46.13,7.52 43.48,10.16 31.09,10.16 C8.1
  Bottom 0.254: R31.A 63.8,7.72 63.2,7.72 60.96,9.96 57.91,9.96 55.27,7.32 R32.A | 31.5,32.72 28.85,30.07 28.85,12.39 31.09,10.16 C8.1 | 31.5,32.72 31.7,32.92 IC1.7 31.5,32.72 | 31.5,32.72 29.46,34.75 29.46,40.23 31.7,42.47 31.7,57.1 R24.1
PGC
  Bottom 0.254: IC6.27 58.73,51 63.2,55.47 64.21,55.47 65.63,56.9 PICKIT2.5
PGD
  Bottom 0.254: IC6.28 56.08,51 58.12,53.03 59.13,53.03 62.99,56.9 PICKIT2.4
PLLACQ  (via drill 0.61)
  Top 0.254: v57.91,37.39 57.3,37.39 46.53,48.16 37.39,48.16 37.19,47.95 37.19,46.74 U1.7
  Bottom 0.254: v57.91,37.39 57.91,38 62.18,42.27 62.18,44.5 63.2,45.52 78.84,45.52 80.87,43.48 81.28,43.48 IC6.11
PTT  (via drill 0.61)
  Top 0.254: v33.33,48.56 31.09,50.8 14.02,50.8 11.58,48.36 R18.2 | R19.1 82.7,30.28 79.45,30.28 75.39,34.34 69.29,34.34 61.16,42.47 61.16,43.28 IC6.3
  Bottom 0.254: v33.33,48.56 34.34,48.56 34.75,48.97 35.15,48.97 51,33.12 51,32.72 53.24,30.48 54.86,30.48 56.9,32.51 56.9,38.41 60.96,42.47 60.96,43.28 IC6.3
RCFB
  Top 0.254: U1.10 39.01,46.53 39.01,39.01 42.47,35.56 C14.2
  Bottom 0.254: R17.2 42.67,31.9 42.67,35.36 C14.2
RX-232
  Top 0.254: IC6.18 81.28,51 81.28,51.61 77.62,55.27 73.97,55.27 72.14,57.1 SERIAL.1
RXCLOCK  (via drill 0.61)
  Top 0.254: v35.36,58.52 35.36,52.63 U1.21
  Bottom 0.254: v35.36,58.52 37.19,58.52 38.2,59.54 68.89,59.54 70.92,57.51 70.92,54.86 73.76,52.02 73.76,51 IC6.21
RXDATA  (via drill 0.61)
  Top 0.254: v65.23,55.27 65.02,55.07 60.15,55.07 59.94,55.27 49.38,55.27 45.52,59.13 37.19,59.13 35.97,57.91 35.97,52.63 U1.20
  Bottom 0.254: v65.23,55.27 65.23,52.63 66.04,51.82 66.04,51 IC6.24
RXDATA/SPKR
  Bottom 0.254: R1.E 77.83,7.72 77.83,9.96 84.53,16.66 90.22,16.66 97.54,23.98 97.54,24.59 X2.3
RXDCACQ  (via drill 0.61)
  Top 0.254: v39.62,32.51 36.58,35.56 36.58,46.53 U1.6 | v53.44,27.84 56.29,27.84 58.52,30.07 64.01,30.07 64.41,29.67 69.09,29.67 72.75,33.33 v75.18,33.33 | v82.97,41.13 84.12,43.28 IC6.12
  Bottom 0.254: v39.62,32.51 44.3,27.84 v53.44,27.84 | v75.18,33.33 75.18,35.34 v82.97,41.13
RXHOLD  (via drill 0.61)
  Top 0.254: v33.93,44.91 34.95,44.91 35.76,45.72 35.76,46.53 U1.5
  Bottom 0.254: v33.93,44.91 33.93,46.74 32.31,48.36 32.31,56.08 33.12,56.9 33.12,57.51 35.76,60.15 76.2,60.15 79.05,57.3 79.05,55.68 75.39,52.02 75.39,49.78 79.65,45.52 84.53,45.52 86.56,43.48 IC6.13
RXSIGIN
  Top 0.254: U1.11 39.62,46.53 39.62,41.05 45.11,35.56 C14.1 | R2.2 69.7,18.69 67.06,21.34 61.98,21.34 59.54,23.77 55.88,23.77 47.75,31.9 45.52,31.9 R17.1
  Bottom 0.254: R17.1 45.31,31.9 45.31,35.36 C14.1
RXSN
  Top 0.254: 33.93,54.86 33.93,56.9 34.14,57.1 R24.2 | 33.93,54.86 33.93,52.63 U1.23 | 33.93,54.86 21.34,54.86 R14.1
TRXPTT
  Bottom 0.254: Q2.3 90.63,27.64 90.83,27.84 93.88,27.84 D2.C 94.08,27.64 94.28,27.43 97.54,27.43 X2.4
TX-232
  Top 0.254: IC6.17 83.92,51 83.92,51.41 78.23,57.1 77.42,57.1 SERIAL.3
TX/SN  (via drill 0.61)
  Top 0.254: v45.92,36.78 v50.6,36.78 | v33.73,41.25 32.51,42.47 30.48,42.47 v30.07,42.06
  Bottom 0.254: C1.1 17.88,53.65 19.3,52.22 21.13,52.22 R14.2 21.13,52.02 30.07,43.08 v30.07,42.06 | v50.6,36.78 50.6,36.58 53.44,33.73 55.07,33.73 56.08,34.75 56.08,38.41 58.52,40.84 58.52,43.28 IC6.2 | v45.92,36.78 41.45,41.25 v33.73,41.25
TXCLOCK  (via drill 0.61)
  Top 0.254: v35.15,51.21 34.54,51.82 34.54,52.43 U1.22
  Bottom 0.254: v35.15,51.21 39.42,55.47 52.43,55.47 53.44,56.49 53.44,57.71 54.66,58.93 68.68,58.93 70.31,57.3 70.31,52.63 71.12,51.82 71.12,51 IC6.22
TXDATA  (via drill 0.61)
  Top 0.254: v36.58,51.21 36.58,52.43 U1.19 | v52.02,32.92 56.9,32.92 58.73,34.75 64.82,34.75 v66.24,36.17
  Bottom 0.254: v36.58,51.21 37.19,51.21 48.97,39.42 48.97,35.97 v52.02,32.92 | v66.24,36.17 66.24,37.59 71.12,42.47 71.12,43.28 IC6.7
TXDATA/MIC
  Bottom 0.254: R8.1 91.85,6.71 91.85,10.97 92.25,11.38 C21.2 92.46,11.58 97.54,16.66 97.54,19.1 X2.1
TXOUT  (via drill 0.61)
  Top 0.254: v39.22,53.85 38.41,53.03 38.41,52.63 U1.16
  Bottom 0.254: v39.22,53.85 49.38,53.85 49.58,53.65 R6.1
USB+
  Bottom 0.254: IC6.16 86.56,50.8 89.61,47.75 99.36,47.75 100.58,48.97 100.58,49.38 J1.D+
USB-
  Bottom 0.254: IC6.15 89.2,50.8 97.33,50.8 98.55,49.58 J1.D-
VBIAS
  Top 0.254: U1.9 38.41,46.53 38.41,34.95 41.05,32.31 41.05,27.03 41.66,26.42 R15.2
  Bottom 0.254: R5.2 50.8,26.21 46.33,26.21 C6.1 46.13,26.21 41.86,26.21 R15.2
VCC  (via drill 0.61)
  Top 0.254: IC1.16 24.18,17.88 24.18,20.32 IC1.15 | 34.95,46.74 35.15,46.74 U1.4 | 34.95,46.74 34.54,46.74 U1.3 | 34.95,48.16 33.12,49.99 33.12,52.43 U1.24 | 34.95,46.74 v34.95,47.95 34.95,48.16 | 37.8,51 37.8,52.43 U1.17 | 34.95,48.16 37.8,51 | 38.61,51.21 38.41,51 37.8,51 | 38.61,51.21 39.01,51.61 39.01,52.43 U1.15 | R25.1 31.9,40.64 18.69,40.64 16.26,38.2 11.58,38.2 R28.1 | R27.1 11.38,15.24 9.75,16.87 9.75,23.57 11.58,25.4 R22.2 | IC6.20 76.2,51 76.2,51.82 73.97,54.05 58.12,54.05 R12.1 57.91,54.25 57.3,54.25 54.46,51.41 54.46,49.38 | 54.46,49.38 54.46,42.27 59.33,37.39 C11.1 | 38.61,51.21 40.44,49.38 54.46,49.38
  Bottom 0.254: R27.1 16.66,15.24 17.07,14.83 C5.1 17.27,14.63 20.32,17.68 23.98,17.68 IC1.16 | v34.95,47.95 34.95,43.69 32.11,40.84 R25.1 | R22.2 11.58,25.4 13.01,26.82 13.01,31.29 11.38,32.92 R21.2 11.38,33.12 11.38,38 R28.1 11.38,38.2 13.01,39.83 13.01,53.03 R20.2 | IC5.8 64.82,23.16 62.18,23.16 R13.1 61.98,23.37 59.54,20.93 57.51,20.93 | 57.51,20.93 55.47,20.93 C17.2 | 57.51,20.93 57.51,33.12 59.33,34.95 59.33,37.19 C11.1 | R12.1 58.12,54.25 58.12,56.69 57.91,56.9 PICKIT2.2 | IC6.20 76.4,51 76.4,51.61 80.26,55.47 82.09,55.47 83.92,57.3 PWR.2
VPP
  Bottom 0.254: PICKIT2.1 55.47,56.9 55.47,54.25 R12.2 55.27,54.05 54.46,53.24 54.46,45.72 55.88,44.3 55.88,43.48 IC6.1 55.88,43.28 55.88,40.03 54.05,38.2 PROG.2

### Text on the board
Bottom: USB | RADIO
tPlace: http://www.gmskhotspot.com | PWR | PTT | LOW | MED | HIGH | DCOS | NQSMHS V2.4 | NI2O 06/2011 | Analog frontend by VE2HOT | COS | DCOS | Low | Medium | High | RX | TX
tNames: Serial #